# EAGLE design YellowMotorEncoder (EAGLE 9.6.0)
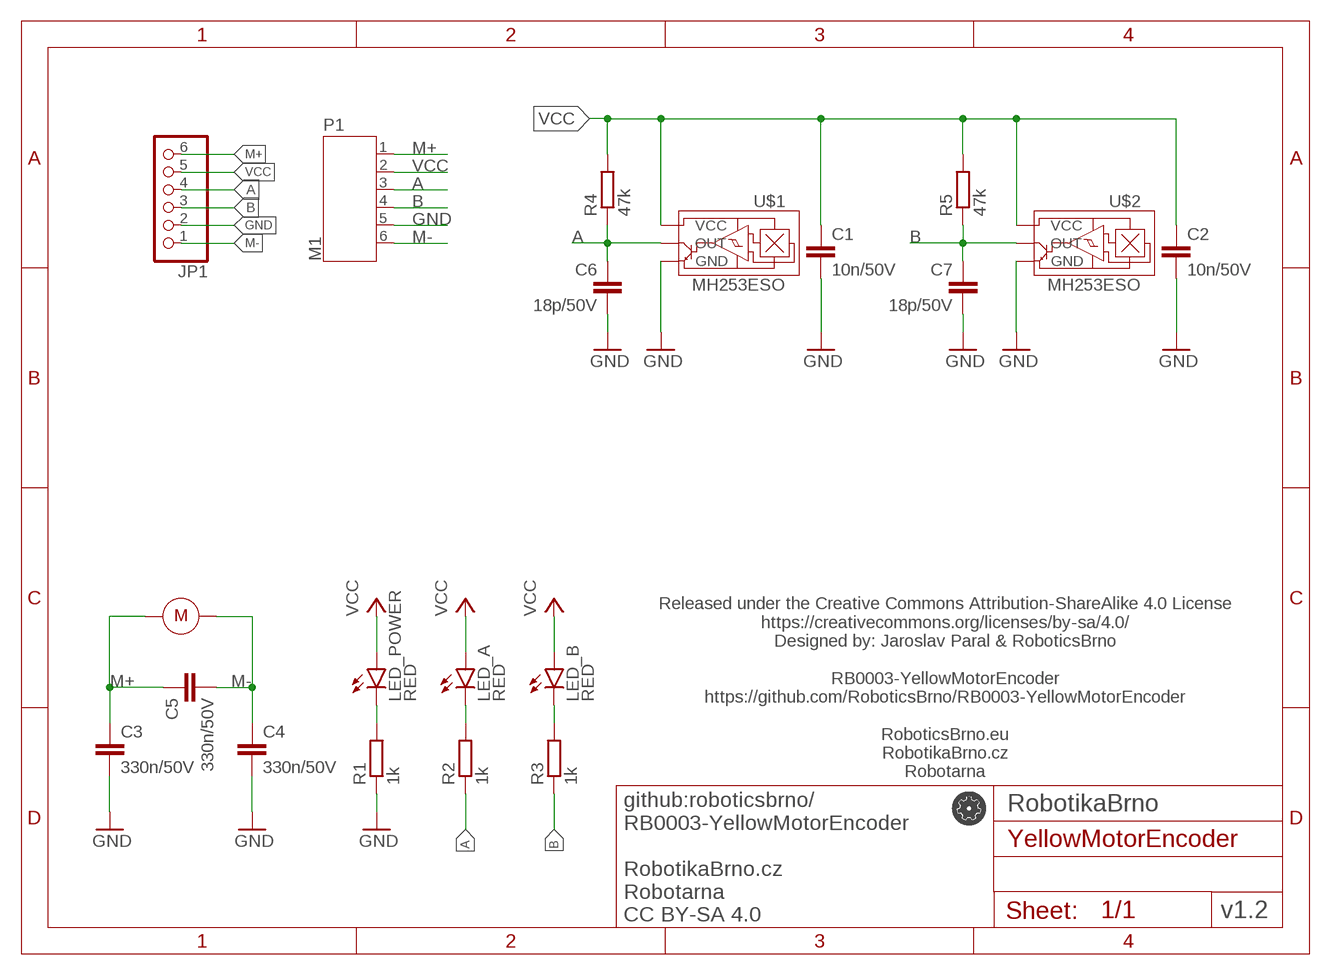
[diagram p0: schematic, sheet 1]

## Parts
C1  10n/50V  C-EUC0402  [C0402]
C2  10n/50V  C-EUC0402  [C0402]
C3  330n/50V  C-EUC0805  [C0805]
C4  330n/50V  C-EUC0805  [C0805]
C5  330n/50V  C-EUC0805  [C0805]
C6  18p/50V  C-EUC0402  [C0402]
C7  18p/50V  C-EUC0402  [C0402]
JP1  PINHD-1X6  [1X06]
LED_A  RED  LEDCHIPLED_0603  [CHIPLED_0603]
LED_B  RED  LEDCHIPLED_0603  [CHIPLED_0603]
LED_POWER  RED  LEDCHIPLED_0603  [CHIPLED_0603]
P1  M1  JST-PH6  [JST-PH6]
R1  1k  R-EU_R0603  [R0603]
R2  1k  R-EU_R0603  [R0603]
R3  1k  R-EU_R0603  [R0603]
R4  47k  R-EU_R0603  [R0603]
R5  47k  R-EU_R0603  [R0603]
U$1  MH253ESO  [SOT23]
U$2  MH253ESO  [SOT23]
U$3  YELLOW_MOTOR  [YELLOW_MOTOR]

## Nets
A: C6.1 JP1.4 P1.3 R2.1 R4.1 U$1.2(OUT)
B: C7.1 JP1.3 P1.4 R3.1 R5.1 U$2.2(OUT)
GND: C1.2 C2.2 C3.2 C4.2 C6.2 C7.2 JP1.2 P1.5 R1.1 U$1.3(GND) U$2.3(GND)
LED_POWER: LED_POWER.C R1.2
LED_SIDE1: LED_A.C R2.2
LED_TOP1: LED_B.C R3.2
M+: C3.1 C5.1 JP1.6 P1.1 U$3.P$2
M-: C4.1 C5.2 JP1.1 P1.6 U$3.P$1
VCC: C1.1 C2.1 JP1.5 LED_A.A LED_B.A LED_POWER.A P1.2 R4.2 R5.2 U$1.1(VCC) U$2.1(VCC)

## Notes on the sheet
- Released under the Creative Commons Attribution-ShareAlike 4.0 License
  https://creativecommons.org/licenses/by-sa/4.0/
  Designed by: Jaroslav Paral & RoboticsBrno
  
  RB0003-YellowMotorEncoder
  https://github.com/RoboticsBrno/RB0003-YellowMotorEncoder
  
  RoboticsBrno.eu
  RobotikaBrno.cz
  Robotarna
- RobotikaBrno
- v1.2
- github:roboticsbrno/
  RB0003-YellowMotorEncoder
  
  RobotikaBrno.cz
  Robotarna
  CC BY-SA 4.0

## Library data of the parts
C1 C2 = rcl:C-EU: CAPACITOR, European symbol; DESCRIPTION: MULTILAYER CERAMIC CAPACITORS MLCC - SMD/SMT 10NF 50V 0402 ROHS; EXTENDED: NO; LCSC_ID: C15195; MF: Samsung Electro-Mechanics; MF_ID: CL05B103KB5NNNC; PACKAGE: 0402; PADS: 2; PRICE_1PLUS: $0.0054; PRICE_200PLUS: $0.0021; PRICE_DATE: 2020-05-08
C3-C5 = rcl:C-EU: CAPACITOR, European symbol; DESCRIPTION: MULTILAYER CERAMIC CAPACITORS MLCC - SMD/SMT 330NF 50V 0805 ROHS; EXTENDED: NO; LCSC_ID: C1740; MF: Guangdong Fenghua Advanced Tech; MF_ID: 0805B334K500NT; PACKAGE: 0805; PADS: 2; PRICE_1PLUS: $0.0227; PRICE_200PLUS: $0.0109; PRICE_DATE: 2020-05-08
C6 C7 = rcl:C-EU: CAPACITOR, European symbol; DESCRIPTION: MULTILAYER CERAMIC CAPACITORS MLCC - SMD/SMT 18PF 50V 0402 ROHS; EXTENDED: NO; LCSC_ID: C1549; MF: Guangdong Fenghua Advanced Tech; MF_ID: 0402CG180J500NT; PACKAGE: 0402; PADS: 2; PRICE_1000PLUS: $0.0006; PRICE_1PLUS: $0.0018; PRICE_DATE: 2020-05-08
JP1 = pinhead:PINHD-1X6: PIN HEADER
LED_A LED_B LED_POWER = led:LED: LED; DESCRIPTION: LIGHT EMITTING DIODES (LED) RED 520~625NM 90~100MCD@20MA TOP VIEW 0603 ROHS; DIGIKEY: 160-1446-1-ND; EXTENDED: NO; FARNELL: 2293494; LCSC_ID: C2286; MF: Hubei KENTO Elec; MF_ID: KT-0603R; MOUSER: 859-LTST-C191KGKT; PADS: 2; PRICE_1PLUS: $0.0079; PRICE_200PLUS: $0.0031; PRICE_DATE: 2020-03-27; RS: 872-1799
P1 = jst-ph:JST-PH6
R1-R3 = rcl:R-EU_: RESISTOR, European symbol; DESCRIPTION: CHIP RESISTOR - SURFACE MOUNT 1KOHMS ±1% 1/10W 0603 ROHS; EXTENDED: NO; LCSC_ID: C21190; MF: Uniroyal Elec; MF_ID: 0603WAF1001T5E; PACKAGE: 0603; PADS: 2; PRICE_1000PLUS: $0.0005; PRICE_1PLUS: $0.0016; PRICE_DATE: 2020-05-08
R4 R5 = rcl:R-EU_: RESISTOR, European symbol; DESCRIPTION: CHIP RESISTOR - SURFACE MOUNT 47KOHMS ±1% 1/10W 0603 ROHS; EXTENDED: NO; LCSC_ID: C25819; MF: Uniroyal Elec; MF_ID: 0603WAF1001T5E; PACKAGE: 0603; PADS: 2; PRICE_1000PLUS: $0.0005; PRICE_1PLUS: $0.0016; PRICE_DATE: 2020-05-08
U$1 U$2 = hall_sensor:MH253ESO; EXTENDED: YES; LCSC_ID: C114369; MF: Magnesensor Tech (MST); MF_ID: MH253ESO; PACKAGE: SOT-23-3L; PADS: 3; PRICE_1000PLUS: 0.0889; PRICE_100PLUS: 0.0929; PRICE_10PLUS: 0.1049; PRICE_1PLUS: 0.1375; PRICE_DATE: 2020-05-01
U$3 = motor:YELLOW_MOTOR

## Net classes
0 default: width 0.15 mm, drill 0.3 mm, clearance 0.15 mm

## Board
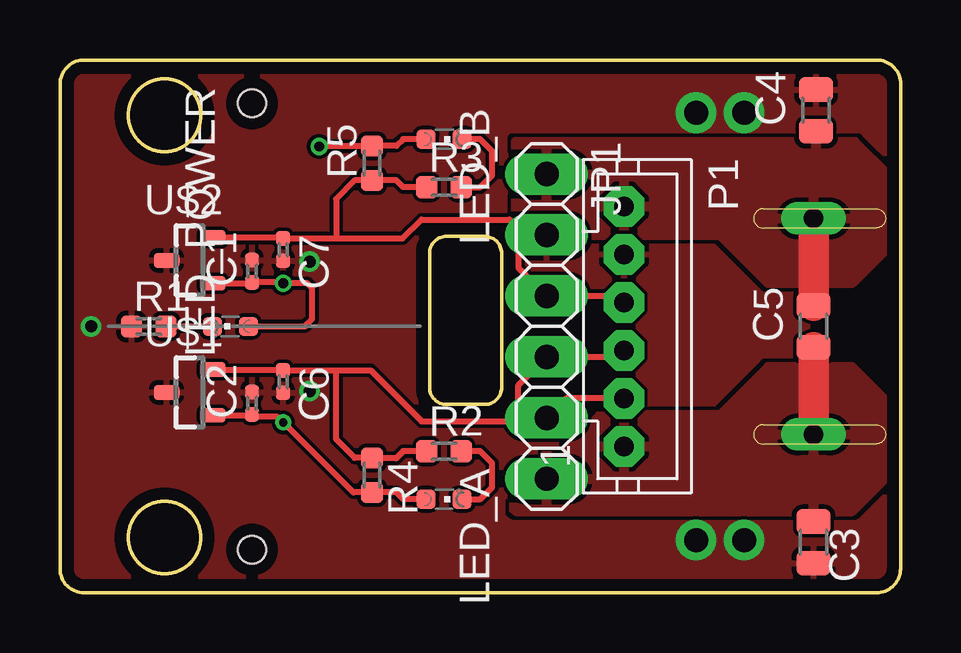
[diagram p1: board, top side]
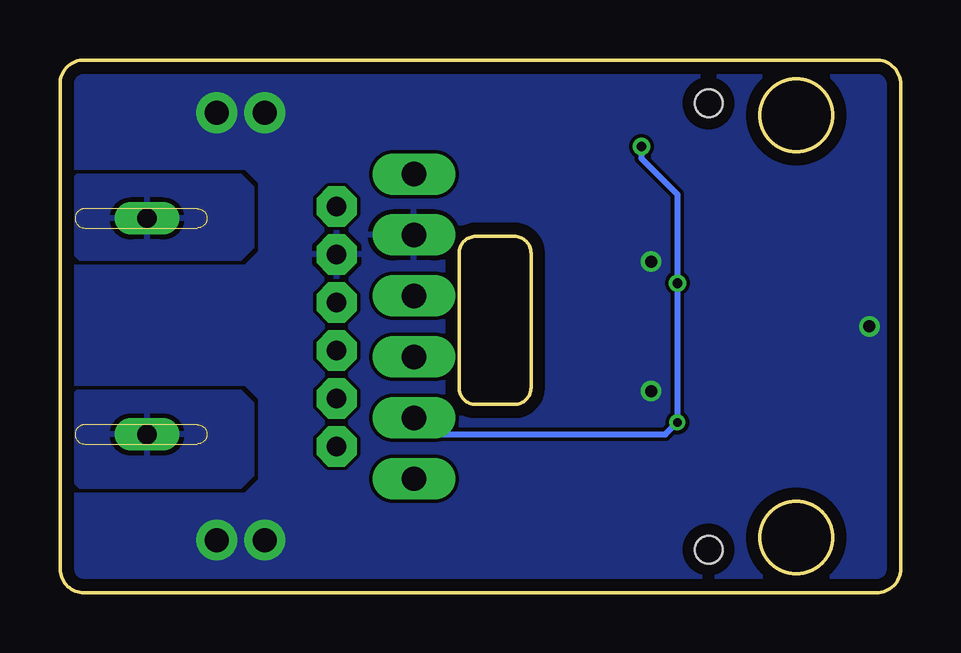
[diagram p2: board, bottom side, seen from below]

Size 35.03 x 22.2 mm. Coordinates in mm from the lower left corner, seen from the top.
Outline: 16.1,14.85 arc90 15.4,14.15 15.4,8.55 arc90 16.1,7.85 17.7,7.85 arc90 18.4,8.55 18.4,14.15 arc90 17.7,14.85 16.1,14.85
Outline: 0,21.2 0,1 arc90 1,0 34.02,0 arc90 35.02,1 35.02,17.7 35.03,21.2 arc90 34.03,22.2 1.03,22.2 arc91 0,21.2
Outline: circle at 4.35,19.9 radius 1.5
Outline: circle at 4.35,2.3 radius 1.5
Copper layers (1*16): Top 0.035mm / dielectric 1.5mm / Bottom 0.035mm
Design rules "robotikabrno": minimum track width 0.15mm, minimum drill 0.3mm, track to track 0.15mm, track to pad 0.15mm, pad to pad 0.15mm, via to via 0.15mm, smd to smd 0.15mm, copper to edge 0.5mm, drill to drill 0.5mm, minimum pad ring 0.16mm, minimum via ring 0.16mm, stop-mask expansion 0.1mm, vias tented up to drill 0.4mm, thermal gap 0.2mm
Holes 1.15 mm at 8,20.4 8,1.8

### Footprints (pad centres in the part's own frame; a part is rotated, then mirrored left to right if it is on the bottom)
C0402 = smd 0.6 x 0.58: 1 -0.465,0; 2 0.465,0
C0805 = smd 1.03 x 1.42: 1 -0.87,0; 2 0.87,0
1X06 = drill 1.016 long: 1 -6.35,0; 2 -3.81,0; 3 -1.27,0; 4 1.27,0; 5 3.81,0; 6 6.35,0
CHIPLED_0603 = smd 0.8 x 0.8: A 0.75,0; C -0.75,0
JST-PH6 = drill 0.813 pad 1.676 octagon: 1 5,0; 2 3,0; 3 1,0; 4 -1,0; 5 -3,0; 6 -5,0
R0603 = smd 0.89 x 0.93: 1 -0.72,0; 2 0.72,0
SOT23 = smd 1.05 x 0.61: 1 0.96,-0.95; 2 0.96,0.95; 3 -0.96,0
YELLOW_MOTOR = drill 0.8 long: P$1 -4.5,0; P$2 4.5,0

### Placement (x,y rotation side)
C1  8,13.4 90 top
C2  8,7.9 90 top
C3  31.4,2.1 270 top
C4  31.5,20.1 90 top
C5  31.4,11.1 90 top
C6  9.3,8.8 270 top
C7  9.3,14.3 270 top
JP1  20.28,11.1 270 top
LED_A  16,3.9 180 top
LED_B  16,18.9 180 top
LED_POWER  7.1,11.1 0 top
P1  23.5,11.1 270 top
R1  3.7,11.1 0 top
R2  16,5.9 0 top
R3  16,16.9 0 top
R4  13,4.9 270 top
R5  13,17.9 90 top
U$1  5.4,8.35 0 top
U$2  5.4,13.85 0 top
U$3  31.4,11.1 270 top

### Tracks (layer width: path | path; a pad name or v marks a point on that pad's centre or on a via)
A
  Top 0.254: P1.3 23.23,9.83 JP1.4 19.1,8.65 19.1,7.51 18.74,7.15 15.06,7.15 12.95,9.27 11.5,9.27 | 11.5,9.27 C6.1 6.39,9.27 U$1.2 | R2.1 14.3,5.9 14,5.6 13.02,5.6 R4.1 12.28,5.62 11.5,6.4 11.5,9.27
B
  Top 0.152: C7.1 9.5,14.77 | C7.1 | C7.1 9.3,14.8
  Top 0.254: P1.4 23.23,12.37 JP1.3 19.1,13.55 19.1,15.19 18.74,15.55 15.06,15.55 14.28,14.77 11.5,14.77 | 9.3,14.8 U$2.2 | 9.5,14.77 11.5,14.77 | R3.1 14.3,16.9 14,17.2 13.02,17.2 R5.1 12.28,17.18 11.5,16.4 11.5,14.77
GND  (via drill 0.5, 1)
  other vias: 26.5,20 28.5,20 26.5,2.2 28.5,2.2 10.4,8.4 10.4,13.8 1.3,11.1
  pour Top (rank 3): -1,24 -1,-1 36,-1 36,24
  pour Bottom (rank 3): -1,24 -1,-1 36,-1 36,24
LED_POWER
  Top 0.254: R1.2 LED_POWER.C
LED_SIDE1
  Top 0.254: LED_A.C 17.5,3.9 18,4.4 18,5.4 17.5,5.9 R2.2
LED_TOP1
  Top 0.254: R3.2 17.5,16.9 18,17.4 18,18.4 17.5,18.9 LED_B.C
M+
  Top 1.27: C5.1 U$3.P$2
  pour Top: 19.7,5.7 18.9,4.9 18.9,3.5 19,3.4 33,3.4 34.5,4.9 34.5,7.9 33,9.4 29.5,9.4 27.5,7.4 22.5,7.4 20.8,5.7
  pour Bottom: 34.3,8.4 27.5,8.4 27,7.9 27,4.9 27.5,4.4 34.2,4.4 34.8,5 34.8,7.9
M-
  Top 1.27: C5.2 U$3.P$1
  pour Top (rank 2): 19,18.8 33.1,18.8 34.5,17.4 34.5,14.4 33,12.9 29.5,12.9 27.5,14.9 22,14.9 21,15.9 19,15.9
  pour Bottom: 27,16.9 27,14.4 27.5,13.9 34.2,13.9 34.8,14.5 34.8,16.9 34.3,17.4 27.5,17.4
VCC  (via drill 0.35, 0.4)
  Top 0.254: P1.2 21.09,8.1 JP1.5 | U$2.1 7.96,12.9 C1.1 9.27,12.94 v9.3,12.9 10.3,12.9 10.5,12.7 10.5,11.4 10.2,11.1 LED_POWER.A | v10.8,18.6 12.98,18.6 R5.2 14.02,18.62 14.3,18.9 LED_B.A | LED_A.A 14.3,3.9 14,4.2 13.02,4.2 R4.2 12.22,4.18 v9.3,7.1 9.06,7.33 8.1,7.33 C2.1 7.96,7.4 U$1.1
  Bottom 0.254: v10.8,18.6 10.8,18.1 9.3,16.6 v9.3,12.9 v9.3,7.1 9.8,6.6 19.59,6.6 JP1.5

### Text on the board
tDocu: YellowMotorEncoder | v1.2 CC BY-SA 4.0 | B | M- / GND / B / A / VCC / M+ | JLCJLCJLCJLC | M- / GND / B / A / VCC / M+ | A | github::roboticsbrno/ | RB0003-YellowMotorEncoder
bDocu: B | M- / GND / B / A / VCC / M+ | A